# Altium schematic sheet System.SchDoc: System
size 431 x 279 mm; CheckedBy: Lance Bantoto; Engineer: Chealsie Bains; DocumentNumber: 12; Revision: 1; SheetNumber: 12; SheetTotal: 23
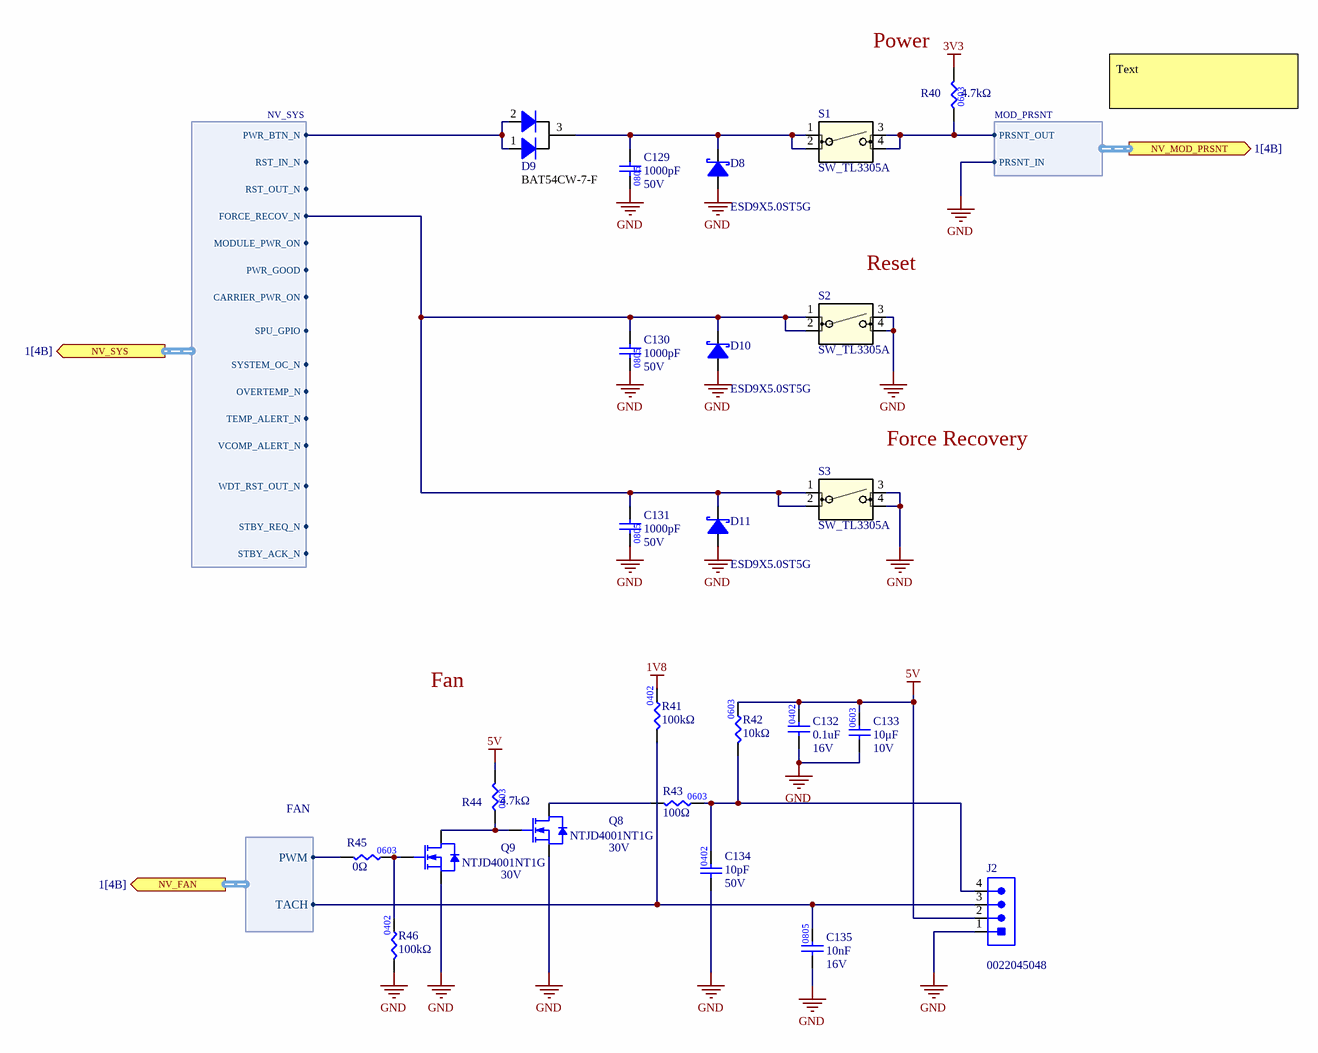
[diagram p0: System.SchDoc]

## Parts
C129  value 1000pF  Voltage Rating: 50V  [CAP2012]  (hidden comment: CAP_1000pF_50V_0805)
C130  value 1000pF  Voltage Rating: 50V  [CAP2012]  (hidden comment: CAP_1000pF_50V_0805)
C131  value 1000pF  Voltage Rating: 50V  [CAP2012]  (hidden comment: CAP_1000pF_50V_0805)
C132  Rated DC Voltage (URdc): 16V  Capacitance: 0.1uF  [CAP0402]  (hidden comment: CAP_0.1uF_16V_X7R_0402)
C133  value 10μF  Voltage Rating: 10V  [CAP0603]  (hidden comment: CAP_10uF_10V_0603)
C134  Capacitance: 10pF  Voltage: 50V  [CAP0402]  (hidden comment: CAP_10pF_50V_0402)
C135  value 10nF  Voltage Rating: 16V  [CAP2012]  (hidden comment: CAP_10nF_16V_0805)
D8  Manufacturer Part Number 1: ESD9X5.0ST5G  [SOD-923]  (hidden comment: TVS_DIODE_UNIDIR_5V)
D9  BAT54CW-7-F  [SOT323]
D10  Manufacturer Part Number 1: ESD9X5.0ST5G  [SOD-923]  (hidden comment: TVS_DIODE_UNIDIR_5V)
D11  Manufacturer Part Number 1: ESD9X5.0ST5G  [SOD-923]  (hidden comment: TVS_DIODE_UNIDIR_5V)
J2  Manufacturer Part Number: 0022045048  (hidden comment: CON_4POS)
Q8  DS Breakdown Voltage-Min: 30V  Manufacturer Part Number 1: NTJD4001NT1G  [SOT363]  (hidden comment: NMOS_30V_0.25A)
Q9  DS Breakdown Voltage-Min: 30V  Manufacturer Part Number 1: NTJD4001NT1G  [SOT363]  (hidden comment: NMOS_30V_0.25A)
R40  value 4.7kΩ  [RES0603]  (hidden comment: RES_4.7kΩ_0603)
R41  value 100kΩ  [RES0402]  (hidden comment: RES_100kΩ_0402_5%)
R42  value 10kΩ  [RES0603]  (hidden comment: RES_10kΩ_0603_5%)
R43  value 100Ω  [RES0603]  (hidden comment: RES_100Ω_0603)
R44  value 4.7kΩ  [RES0603]  (hidden comment: RES_4.7kΩ_0603)
R45  value 0Ω  [RES0603]  (hidden comment: RES_0Ω_0603)
R46  value 100kΩ  [RES0402]  (hidden comment: RES_100kΩ_0402_5%)
S1  SW_TL3305A  [SW_TL3305AF260QG]
S2  SW_TL3305A  [SW_TL3305AF260QG]
S3  SW_TL3305A  [SW_TL3305AF260QG]

## Ports
NV_FAN (out, harness FAN, see 1[4B]), NV_MOD_PRSNT (out, harness MOD_PRSNT, see 1[4B]), NV_SYS (out, harness NV_SYS, see 1[4B])

## Harnesses
FAN: PWM, TACH
NV_SYS: PWR_BTN_N, RST_IN_N, RST_OUT_N, FORCE_RECOV_N, MODULE_PWR_ON, PWR_GOOD, CARRIER_PWR_ON, SPU_GPIO, SYSTEM_OC_N, OVERTEMP_N, TEMP_ALERT_N, VCOMP_ALERT_N, WDT_RST_OUT_N, STBY_REQ_N, STBY_ACK_N
MOD_PRSNT: PRSNT_IN, PRSNT_OUT

## Nets
1V8: R41.2
3V3: R40.2
5V: C132.2 C133.2 J2.2 R42.2 R44.2
GND: C129.1 C130.1 C131.1 C132.1 C133.1 C134.1 C135.1 D8.1(Anode) D10.1(Anode) D11.1(Anode) J2.1 Q8.2(SOURCE) Q9.2(SOURCE) R46.1 S2.3 S2.4 S3.3 S3.4 ; port NV_MOD_PRSNT.PRSNT_IN
NetC129_2: C129.2 D8.2(Cathode) S1.1 S1.2
NetC130_2: C130.2 C131.2 D10.2(Cathode) D11.2(Cathode) S2.1 S2.2 S3.1 S3.2 ; port NV_SYS.FORCE_RECOV_N
NetC134_2: C134.2 J2.4 R42.1 R43.2
NetC135_2: C135.2 J2.3 R41.1 ; port NV_FAN.TACH
NetD9_1: D9.1 D9.2 ; port NV_SYS.PWR_BTN_N
NetQ8_1: Q8.1(GATE) Q9.3(DRAIN) R44.1
NetQ8_3: Q8.3(DRAIN) R43.1
NetQ9_1: Q9.1(GATE) R45.2 R46.2
NetR40_1: R40.1 S1.3 S1.4 ; port NV_MOD_PRSNT.PRSNT_OUT
NetR45_1: R45.1 ; port NV_FAN.PWM

Not connected (* = marked no-connect by the designer): D9 3

## Notes on the sheet
- Power
- Text
- (near S2) Reset
- (near S3) Force Recovery
- Fan
- University of Waterloo Robotics Team
- 200 University Ave W
- REV
- PROJECT
- Waterloo, Ontario, Canada
- N2L 3G1
- DOCUMENT
- ENGINEER
- REVIEWER
- MODIFIED
- SHEET
- OF
- (in symbol CAP_10nF_16V_0805) 0805
- (in symbol CAP_10uF_10V_0603) 0603
- (in symbol RES_4.7kΩ_0603_5%) 0603
- (in symbol RES_100Ω_0603_1%) 0603

## Library data of the parts
C129-C131 = CAP_1000pF_50V_0805: CAP CER 1000pF 50V X7R 0805; Manufacturer 1: Samsung; Manufacturer Part Number 1: CL21B102KBANNNC; Package/Footprint: 0805; Supplier 1: Digi-Key; Mounting Type: SMD; Supplier Part Number 1: 1276-1020-1-ND; Dielectric: X7R
C132 = CAP_0.1uF_16V_X7R_0402: Ceramic Capacitor, Ceramic; Manufacturer: Taiyo Yuden; Manufacturer Part Number: LMK212AC6106MD-T; Multilayer: Yes; Negative Tolerance: 10%; Temperature Characteristics Code: X7R; Supplier 1: Digi-Key; Supplier Part Number 1: 587-6337-1-ND; RoHS: Yes; Stock 1: 703; Pricing 1: 1=0.29000, 10=0.20100, 50=0.12060, 100=0.10180, 500=0.06966, 1000=0.06163 (USD); ComponentLink1URL: https://datasheet.ciiva.com:443/pdfs/VipMasterIC/IC/TAIY/TAIY-S-A0009099504/TAIY-S-A0009099407-1.pdf?src-supplier=IHS+Markit; ComponentLink1Description: https://datasheet.ciiva.com:443/pdfs/VipMasterIC/IC/TAIY/TAIY-S-A0009099504/TAIY-S-A0009099407-1.pdf?src-supplier=IHS+Markit; ComponentLink2URL: https://ds.yuden.co.jp/TYCOMPAS/ut/detail?pn=LMK212AC6106MD-T &amp;u=M&src-supplier=Digi-Key; ComponentLink2Description: https://ds.yuden.co.jp/TYCOMPAS/ut/detail?pn=LMK212AC6106MD-T &amp;u=M&src-supplier=Digi-Key; Supplier 2: Digi-Key; Supplier Part Number 2: 1292-1630-1-ND; Category: Ceramic Capacitors; Stock 2: 20327886; Pricing 2: 1=0.10000, 10=0.02800, 50=0.01500, 100=0.01220, 500=0.00876, 1000=0.00688, 2500=0.00625, 5000=0.00575 (USD); Mount: Surface Mount; Number of Pins: 2; Dielectric Material: Ceramic; Package Shape: Rectangular; Terminal Finish: Nickel; Min Operating Temperature: -55°C; Max Operating Temperature: 125°C; JESD-609 Code: e3; Capacitor Type: Ceramic; Package Style: SMTMeter; Packaging: Tape and Reel; Positive Tolerance: 10%; Termination: Wraparound; Length: 1mm; Width: 0.5mm; Height: 0.5mm; REACH SVHC: Yes; RoHS Compliant: Yes; ComponentLink3URL: https://datasheet.ciiva.com:443/pdfs/VipMasterIC/IC/WATC/WATC-S-A0009550342/WATC-S-A0009550342-1.pdf?src-supplier=IHS+Markit; ComponentLink3Description: https://datasheet.ciiva.com:443/pdfs/VipMasterIC/IC/WATC/WATC-S-A0009550342/WATC-S-A0009550342-1.pdf?src-supplier=IHS+Markit; ComponentLink4URL: http://www.farnell.com/datasheets/2340522.pdf?src-supplier=Farnell; ComponentLink4Description: http://www.farnell.com/datasheets/2340522.pdf?src-supplier=Farnell; ComponentLink5URL: http://components.arrow.com/part/dataview/0323_00654690?src-supplier=Arrow+Europe; ComponentLink5Description: http://components.arrow.com/part/dataview/0323_00654690?src-supplier=Arrow+Europe; ComponentLink6URL: https://www.verical.com/server-webapp/html/getDatasheet?partID=415228&src-supplier=Verical; ComponentLink6Description: https://www.verical.com/server-webapp/html/getDatasheet?partID=415228&src-supplier=Verical; ComponentLink7URL: http://www.passivecomponent.com/indexsea/0402B104K160CT-IN.pdf?src-supplier=Digi-Key; ComponentLink7Description: http://www.passivecomponent.com/indexsea/0402B104K160CT-IN.pdf?src-supplier=Digi-Key; ComponentLink8URL: http://www.passivecomponent.com/wp-content/uploads/2018/10/MLCC.pdf?src-supplier=Digi-Key; ComponentLink8Description: http://www.passivecomponent.com/wp-content/uploads/2018/10/MLCC.pdf?src-supplier=Digi-Key; ComponentLink9URL: http://www.farnell.com/datasheets/2340522.pdf?src-supplier=Element14; ComponentLink9Description: http://www.farnell.com/datasheets/2340522.pdf?src-supplier=Element14; ComponentLink10URL: http://www.farnell.com/datasheets/2340522.pdf?src-supplier=Newark; ComponentLink10Description: http://www.farnell.com/datasheets/2340522.pdf?src-supplier=Newark; Size Code: 0402; Supplier 3: Digi-Key; Supplier Part Number 3: 445-173645-1-ND; Stock 3: 3627; Pricing 3: 1=0.20000, 10=0.14200, 50=0.08080, 100=0.06700, 500=0.04696, 1000=0.03888, 2500=0.03619, 5000=0.03311 (USD); ComponentLink11URL: https://datasheet.ciiva.com:443/pdfs/VipMasterIC/IC/TDKC/TDKC-S-A0007785269/TDKC-S-A0007785269-1.pdf?src-supplier=IHS+Markit; ComponentLink11Description: https://datasheet.ciiva.com:443/pdfs/VipMasterIC/IC/TDKC/TDKC-S-A0007785269/TDKC-S-A0007785269-1.pdf?src-supplier=IHS+Markit; ComponentLink12URL: https://product.tdk.com/info/en/catalog/spec/mlccspec_commercial_soft_en.pdf?src-supplier=Digi-Key; ComponentLink12Description: https://product.tdk.com/info/en/catalog/spec/mlccspec_commercial_soft_en.pdf?src-supplier=Digi-Key
C133 = CAP_10uF_10V_0603: CAP CER 10UF 10V X5R 0603; Manufacturer Part Number 1: CC0603MRX5R6BB106; Manufacturer 1: Yageo; Supplier Part Number 1: 311-1817-1-ND; Supplier 1: Digi-Key; Dielectric: X5R
C134 = CAP_10pF_50V_0402: Ceramic Capacitor, Multilayer, Ceramic, 50V, 1% +Tol, 1% -Tol, C0G, 30ppm/Cel TC, 0.00001uF, Surface Mount, 0402; Package: 0402
C135 = CAP_10nF_16V_0805: CAP CER 10000PF 16V X7R 0805; Manufacturer 1: Yageo; Manufacturer Part Number 1: AC0805KRX7R7BB103; Supplier 1: Digi-Key; Supplier Part Number 1: 311-3161-1-ND
D8 D10 D11 = TVS_DIODE_UNIDIR_5V: TVS DIODE 5VWM 12.3VC SOD923; Manufacturer 1: ON Semiconductor; Min Breakdown Voltage: 6.2V; Clamping Voltage-Max: 12.3V; Supplier 1: Digi-Key; Supplier Part Number 1: ESD9X5.0ST5GOSCT-ND
D9 = DIODE_30V_SOT323: Diode Array 1 Pair Common Cathode Schottky 30 V 200mA (DC) Surface Mount SC-70, SOT-323; Vendor: Diodes Inc; Built_By: EMA_Anthony; SourceLibrary: Diodes_Inc_2018-12-15; Type: DEV; Copyright: Copyright (C) 2016 Accelerated Designs. All rights reserved; RefDes: RefDes; Manufacturer_Part_Number: BAT54CW-7-F
J2 = CON_4POS: CONN HEADER VERT 4POS 2.54MM; Manufacturer: Molex; Supplier 1: Digi-Key; Supplier Part Number 1: 0022045048-ND; RoHS: Yes; Category: Headers and Wire Housings; Pricing 1: 16000=0.12858 (USD); ComponentLink1URL: https://datasheet.ciiva.com/6839/022045032-sd-6839882.pdf?src-supplier=Digi-Key; ComponentLink1Description: https://datasheet.ciiva.com/6839/022045032-sd-6839882.pdf?src-supplier=Digi-Key
Q8 Q9 = NMOS_30V_0.25A: MOSFET 2N-CH 30V 0.25A SOT-363; Manufacturer 1: ON Semiconductor; Supplier 1: Digi-Key; Supplier Part Number 1: NTJD4001NT1GOSCT-ND
R40 R44 = RES_4.7kΩ_0603_5%: RES 4.7K OHM 5% 1/10W 0603; Manufacturer 1: Yageo; Manufacturer Part Number 1: RC0603JR-074K7L; Supplier Part Number 1: 311-4.7KGRCT-ND; Supplier 1: Digi-Key
R41 R46 = RES_100kΩ_0402_5%: RES SMD 100K OHM 5% 1/10W 0402; Manufacturer Part Number 1: ERJ-2GEJ104X; Manufacturer 1: Panasonic Electronic Components; Power: 0.1W, 1/10W; Package/Footprint: 0402; Supplier 1: Digi-Key; Supplier Part Number 1: P100KJCT-ND; Mounting Type: SMD; Tolerance: 5%
R42 = RES_10kΩ_0603_5%: RES 10K OHM 5% 1/10W 0603; Manufacturer 1: Yageo; Manufacturer Part Number 1: RC0603JR-0710KL; Package/Footprint: 0603; Supplier Part Number 1: 311-10KGRCT-ND; Supplier 1: Digi-Key; Mounting Type: SMD
R43 = RES_100Ω_0603_1%: RES 100 OHM 1% 1/10W 0603; Manufacturer 1: Yageo; Manufacturer Part Number 1: RC0603FR-07100RL; Supplier Part Number 1: 311-100HRCT-ND; Supplier 1: Digi-Key
R45 = RES_0Ω_0603: RES 0 OHM JUMPER 1/10W 0603; Manufacturer 1: Yageo; Manufacturer Part Number 1: RC0603JR-070RL; Package/Footprint: 0603; Supplier Part Number 1: 311-0.0GRCT-ND; Supplier 1: Digi-Key; Mounting Type: SMD
S1-S3 = SW_TL3305A: TL3305A Series SPST 12 V 4.5 x 4.5 mm 260 gf Top Actuated SMT Tactile Switch; Manufacturer Part Number: TL3305AF260QG